# EAGLE design DTR-1_v2021-05-06 (EAGLE 7.6.0)
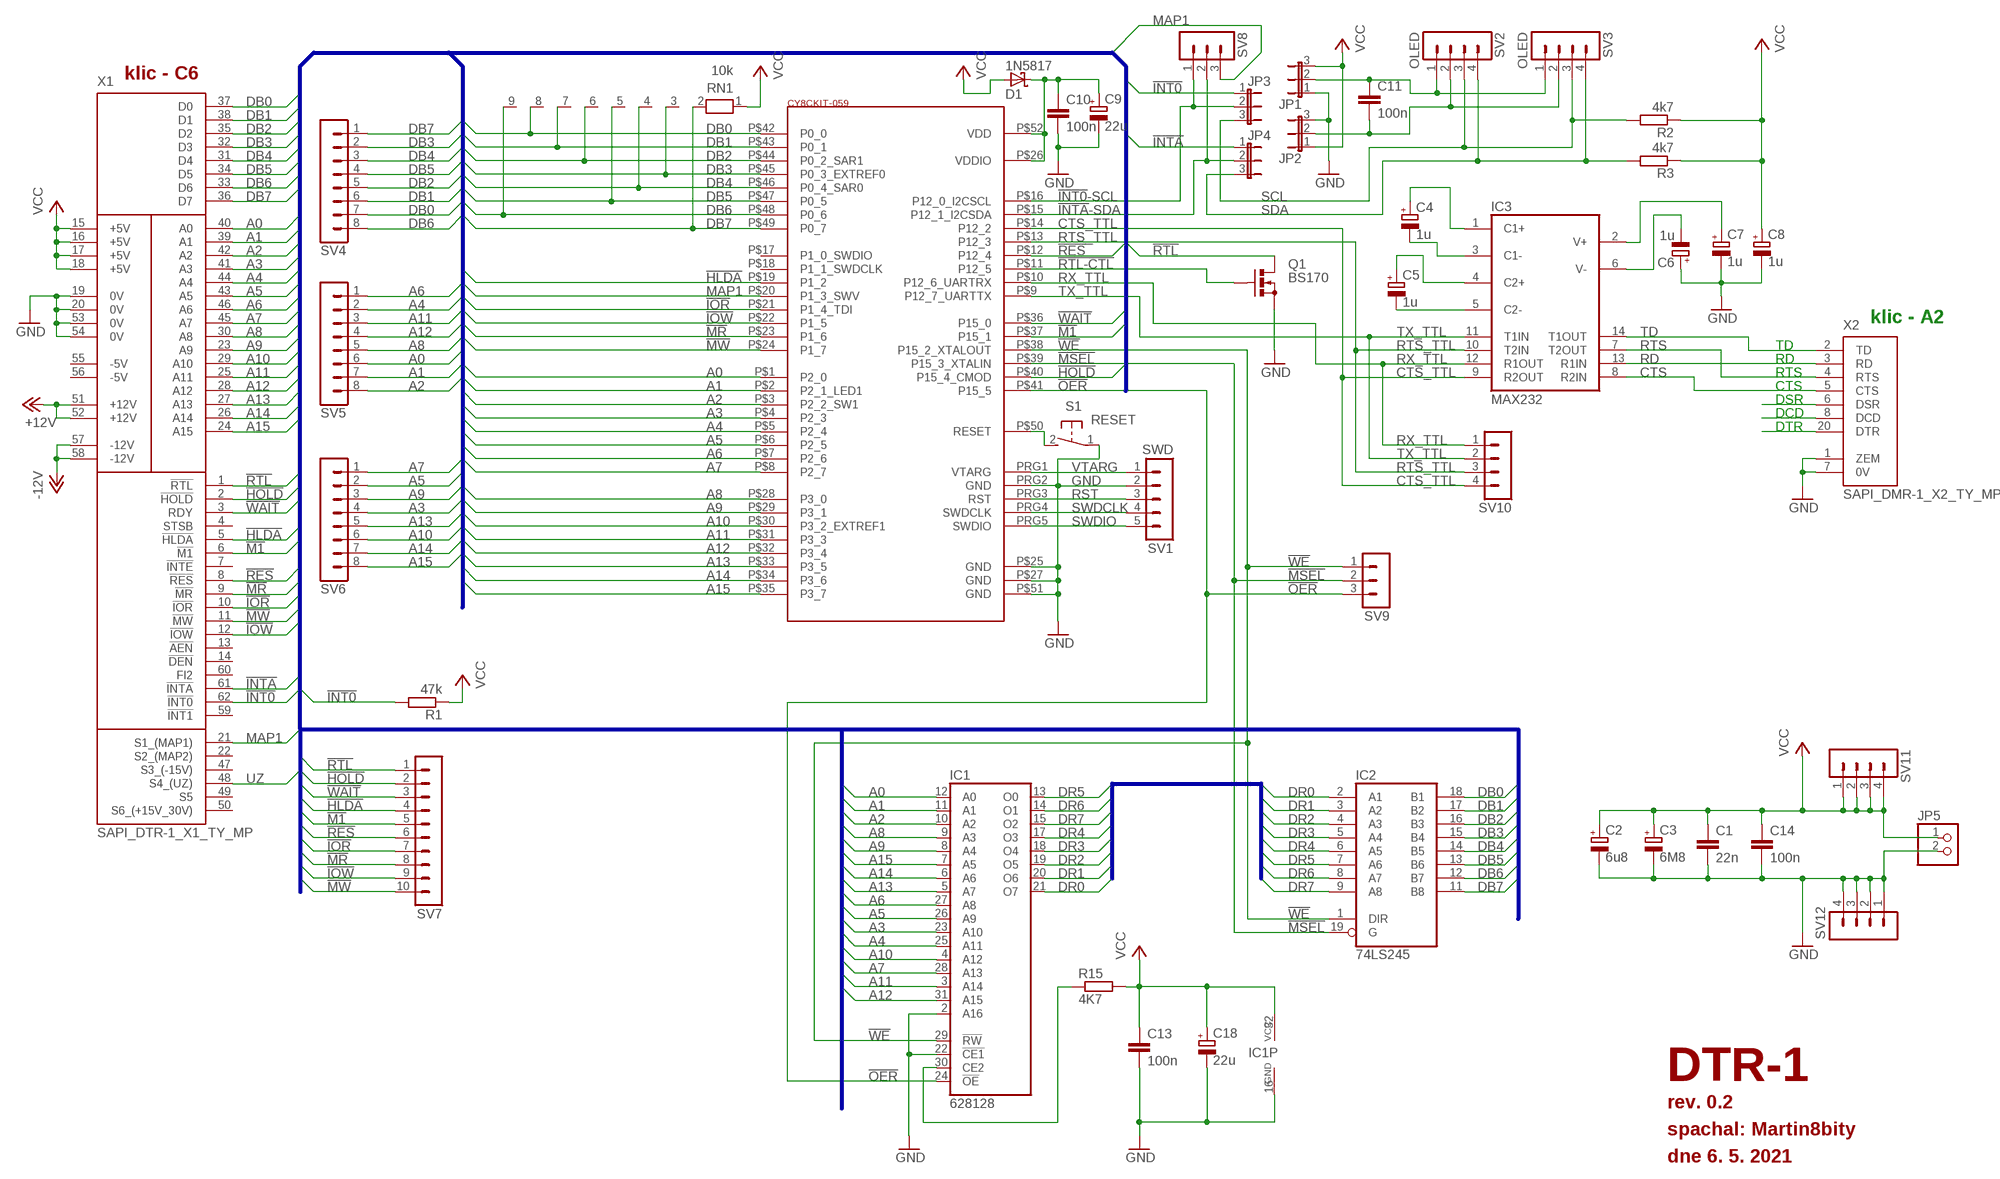
[diagram p0: schematic, sheet 1]

## Parts
C1  22n  C-EU025-024X044  [C025-024X044]
C2  6u8  CPOL-EUE5-4  [E5-4]
C3  6M8  CPOL-EUE2.5-5  [E2,5-5]
C4  1u  CPOL-EUE2.5-5  [E2,5-5]
C5  1u  CPOL-EUE2.5-5  [E2,5-5]
C6  1u  CPOL-EUE2.5-5  [E2,5-5]
C7  1u  CPOL-EUE2.5-5  [E2,5-5]
C8  1u  CPOL-EUE2.5-5  [E2,5-5]
C9  22u  CPOL-EUE2.5-5  [E2,5-5]
C10  100n  C-EU025-024X044  [C025-024X044]
C11  100n  C-EU050-025X075  [C050-025X075]
C13  100n  C-EU025-024X044  [C025-024X044]
C14  100n  C-EU025-024X044  [C025-024X044]
C18  22u  CPOL-EUE2.5-5  [E2,5-5]
D1  1N5817  1N5817-B  [DO41-7.6]
IC1  628128  TC551001CP  [DIL32]
IC2  74LS245  74LS245N  [DIL20]
IC3  MAX232  [DIL16]
JP1  JP2E  [JP2]
JP2  JP2E  [JP2]
JP3  JP2E  [JP2]
JP4  JP2E  [JP2]
JP5  PINHD-1X2  [1X02]
Q1  BS170  [SOT54E]
R1  47k  R-EU_0207/10  [0207/10]
R2  4k7  R-EU_0207/10  [0207/10]
R3  4k7  R-EU_0207/10  [0207/10]
R15  4K7  R-EU_0207/10  [0207/10]
RN1  10k  RN08  [RN-9]
S1  RESET  31-XX  [B3F-31XX]
SV1  SWD  MA05-1  [MA05-1]
SV2  OLED  MA04-1  [MA04-1]
SV3  OLED  MA04-1  [MA04-1]
SV4  MA08-1  [MA08-1]
SV5  MA08-1  [MA08-1]
SV6  MA08-1  [MA08-1]
SV7  MA10-1  [MA10-1]
SV8  MA03-1  [MA03-1]
SV9  MA03-1  [MA03-1]
SV10  MA04-1  [MA04-1]
SV11  MA04-1  [MA04-1]
SV12  MA04-1  [MA04-1]
U$1  CY8CKIT-059  [PSOC-KIT-26]
X1  SAPI_DTR-1_X1_TY_MP  [TY5176211/DTR-1_X1]
X2  SAPI_DMR-1_X2_TY_MP  [TY5133011/DMR-1_X2]

## Nets
!HLDA: SV7.4 U$1.P$19(P1_2) X1.5(!HLDA)
!HOLD: SV7.2 U$1.P$40(P15_4_CMOD) X1.2(!HOLD)
!INT0: JP3.1 R1.2 X1.62(!INT0)
!INT0!-SCL: JP3.2 SV8.1 U$1.P$16(P12_0_I2CSCL)
!INTA: JP4.1 X1.61(!INTA)
!INTA!-SDA: JP4.2 SV8.2 U$1.P$15(P12_1_I2CSDA)
!IOR: SV7.7 U$1.P$21(P1_4_TDI) X1.10(!IOR)
!IOW: SV7.9 U$1.P$22(P1_5) X1.12(!IOW)
!M1: SV7.5 U$1.P$37(P15_1) X1.6(!M1)
!MR: SV7.8 U$1.P$23(P1_6) X1.9(!MR)
!MSEL: IC2.19(G) SV9.2 U$1.P$39(P15_3_XTALIN)
!MW: SV7.10 U$1.P$24(P1_7) X1.11(!MW)
!OER: IC1.24(!OE) SV9.3 U$1.P$41(P15_5)
!RES: SV7.6 U$1.P$12(P12_4) X1.8(!RES)
!RTL: Q1.D SV7.1 X1.1(!RTL)
!RTL-CTL: Q1.G U$1.P$11(P12_5)
!WAIT: SV7.3 U$1.P$36(P15_0) X1.3(RDY)
!WE: IC1.29(!RW) IC2.1(DIR) SV9.1 U$1.P$38(P15_2_XTALOUT)
+12V: X1.51(+12V) X1.52(+12V)
-12V: X1.57(-12V) X1.58(-12V)
A0: IC1.12(A0) SV5.6 U$1.P$1(P2_0) X1.40(A0)
A1: IC1.11(A1) SV5.7 U$1.P$2(P2_1_LED1) X1.39(A1)
A2: IC1.10(A2) SV5.8 U$1.P$3(P2_2_SW1) X1.42(A2)
A3: IC1.23(A10) SV6.4 U$1.P$4(P2_3) X1.41(A3)
A4: IC1.25(A11) SV5.2 U$1.P$5(P2_4) X1.44(A4)
A5: IC1.26(A9) SV6.2 U$1.P$6(P2_5) X1.43(A5)
A6: IC1.27(A8) SV5.1 U$1.P$7(P2_6) X1.46(A6)
A7: IC1.28(A13) SV6.1 U$1.P$8(P2_7) X1.45(A7)
A8: IC1.9(A3) SV5.5 U$1.P$28(P3_0) X1.30(A8)
A9: IC1.8(A4) SV6.3 U$1.P$29(P3_1) X1.23(A9)
A10: IC1.4(A12) SV6.6 U$1.P$30(P3_2_EXTREF1) X1.29(A10)
A11: IC1.3(A14) SV5.3 U$1.P$31(P3_3) X1.25(A11)
A12: IC1.31(A15) SV5.4 U$1.P$32(P3_4) X1.28(A12)
A13: IC1.5(A7) SV6.5 U$1.P$33(P3_5) X1.27(A13)
A14: IC1.6(A6) SV6.7 U$1.P$34(P3_6) X1.26(A14)
A15: IC1.7(A5) SV6.8 U$1.P$35(P3_7) X1.24(A15)
CTS: IC3.8(R2IN) X2.5(CTS)
CTS_TTL: IC3.9(R2OUT) SV10.4 U$1.P$14(P12_2)
DB0: IC2.18(B1) RN1.8 SV4.7 U$1.P$42(P0_0) X1.37(D0)
DB1: IC2.17(B2) RN1.7 SV4.6 U$1.P$43(P0_1) X1.38(D1)
DB2: IC2.16(B3) RN1.6 SV4.5 U$1.P$44(P0_2_SAR1) X1.35(D2)
DB3: IC2.15(B4) RN1.3 SV4.2 U$1.P$45(P0_3_EXTREF0) X1.32(D3)
DB4: IC2.14(B5) RN1.4 SV4.3 U$1.P$46(P0_4_SAR0) X1.31(D4)
DB5: IC2.13(B6) RN1.5 SV4.4 U$1.P$47(P0_5) X1.34(D5)
DB6: IC2.12(B7) RN1.9 SV4.8 U$1.P$48(P0_6) X1.33(D6)
DB7: IC2.11(B8) RN1.2 SV4.1 U$1.P$49(P0_7) X1.36(D7)
DCD: X2.8(DCD)
DR0: IC1.21(O7) IC2.2(A1)
DR1: IC1.20(O6) IC2.3(A2)
DR2: IC1.19(O5) IC2.4(A3)
DR3: IC1.18(O4) IC2.5(A4)
DR4: IC1.17(O3) IC2.6(A5)
DR5: IC1.13(O0) IC2.7(A6)
DR6: IC1.14(O1) IC2.8(A7)
DR7: IC1.15(O2) IC2.9(A8)
DSR: X2.6(DSR)
DTR: X2.20(DTR)
GND: C1.2 C2.- C3.- C6.+ C7.- C8.- C9.- C10.2 C13.2 C14.2 C18.- IC1.2(A16) IC1.16(GND) IC1.22(!CE1) JP1.1 JP2.3 JP5.2 Q1.S S1.1(P) SV1.2 SV12.1 SV12.2 SV12.3 SV12.4 U$1.P$25(GND) U$1.P$27(GND) U$1.P$51(GND) U$1.PRG2(GND) X1.19(0V) X1.20(0V) X1.53(0V) X1.54(0V) X2.1(ZEM) X2.7(0V)
MAP1: SV8.3 U$1.P$20(P1_3_SWV) X1.21(S1_(MAP1))
N$1: C9.+ C10.1 D1.C U$1.P$26(VDDIO) U$1.P$52(VDD)
N$2: S1.2(S) U$1.P$50(RESET)
N$3: C11.1 JP1.2 SV2.1 SV3.1
N$4: C6.- IC3.6(V-)
N$5: C7.+ IC3.2(V+)
N$6: C5.- IC3.5(C2-)
N$7: C5.+ IC3.4(C2+)
N$8: C4.- IC3.3(C1-)
N$9: C4.+ IC3.1(C1+)
N$10: C11.2 JP2.2 SV2.2 SV3.2
N$44: IC1.30(CE2) R15.1
RD: IC3.13(R1IN) X2.3(RD)
RST: SV1.3 U$1.PRG3(RST)
RTS: IC3.7(T2OUT) X2.4(RTS)
RTS_TTL: IC3.10(T2IN) SV10.3 U$1.P$13(P12_3)
RX_TTL: IC3.12(R1OUT) SV10.1 U$1.P$10(P12_6_UARTRX)
SCL: JP3.3 R2.2 SV2.3 SV3.3
SDA: JP4.3 R3.2 SV2.4 SV3.4
SWDCLK: SV1.4 U$1.PRG4(SWDCLK)
SWDIO: SV1.5 U$1.PRG5(SWDIO)
TD: IC3.14(T1OUT) X2.2(TD)
TX_TTL: IC3.11(T1IN) SV10.2 U$1.P$9(P12_7_UARTTX)
UZ: X1.48(S4_(UZ))
VCC: C1.1 C2.+ C3.+ C8.+ C13.1 C14.1 C18.+ D1.A IC1.32(VCC) JP1.3 JP2.1 JP5.1 R1.1 R2.1 R3.1 R15.2 RN1.1 SV11.1 SV11.2 SV11.3 SV11.4 X1.15(+5V) X1.16(+5V) X1.17(+5V) X1.18(+5V)
VTARG: SV1.1 U$1.PRG1(VTARG)
Unconnected: IC1.1(NC) U$1.P$17(P1_0_SWDIO) U$1.P$18(P1_1_SWDCLK) X1.4(STSB) X1.7(!INTE) X1.13(!AEN) X1.14(!DEN) X1.22(S2_(MAP2)) X1.47(S3_(-15V)) X1.49(S5) X1.50(S6_(+15V_30V)) X1.55(-5V) X1.56(-5V) X1.59(!INT1) X1.60(FI2)

## Buses
DB[0..7],A[0..7],A[8..15],A16,!RES,!IOR,!IOW,!INT[0..1],!INTA,!MR,!MW,MAP[1..2],UZ,!RTL,!HOLD,!HLDA,!WAIT,!M1
DR[0..7]

## Notes on the sheet
- klic - C6
- klic - A2
- DTR-1
- rev. 0.2
- spachal: Martin8bity
- dne 6. 5. 2021

## Power pins joined to a net without a drawn wire
GND: IC2.10(GND) IC3.15(GND)
VCC: IC2.20(VCC) IC3.16(VCC)

## Library data of the parts
C1 C10 C11 C13 C14 = rcl:C-EU: CAPACITOR, European symbol
C2-C9 C18 = rcl:CPOL-EU: POLARIZED CAPACITOR, European symbol
D1 = diode:1N581*: 1.0A SCHOTTKY BARRIER RECTIFIER Source: http://www.diodes.com/datasheets/ds23001.pdf
IC1 = memory_MP:TC551001CP: MEMORY
IC2 = 74xx-eu_MP:74*245: Octal BUS TRANSCEIVER, 3-state
IC3 = maxim:MAX232: RS232 TRANSCEIVER; MF: MAXIM; MPN: MAX232ACPE+; OC_FARNELL: 9723773; OC_NEWARK: 68K4544
JP1-JP4 = jumper:JP2E: JUMPER
JP5 = pinhead:PINHD-1X2: PIN HEADER
Q1 = transistor-small-signal:BS170: N-CHANNEL MOS FET
R1-R3 R15 = rcl:R-EU_: RESISTOR, European symbol
RN1 = resistor-net:RN08: RESISTOR NETWORK; OC_FARNELL: unknown; OC_NEWARK: unknown
S1 = switch-omron:31-XX: OMRON SWITCH; MPN: B3F-3100; OC_FARNELL: 959704; OC_NEWARK: 36M3582
SV1 = con-lstb:MA05-1: PIN HEADER; OC_FARNELL: unknown; OC_NEWARK: unknown
SV2 SV3 SV10-SV12 = con-lstb:MA04-1: PIN HEADER; OC_FARNELL: unknown; OC_NEWARK: unknown
SV4-SV6 = con-lstb:MA08-1: PIN HEADER; OC_FARNELL: unknown; OC_NEWARK: unknown
SV7 = con-lstb:MA10-1: PIN HEADER; OC_FARNELL: unknown; OC_NEWARK: unknown
SV8 SV9 = con-lstb:MA03-1: PIN HEADER; OC_FARNELL: unknown; OC_NEWARK: unknown
U$1 = Cypress_PSoC:CY8CKIT-059
X1 = DTR-1_v2021-05-03:SAPI_DTR-1_X1_TY_MP
X2 = con-FRB_TESLA:SAPI_DMR-1_X2_TY_MP

## Board
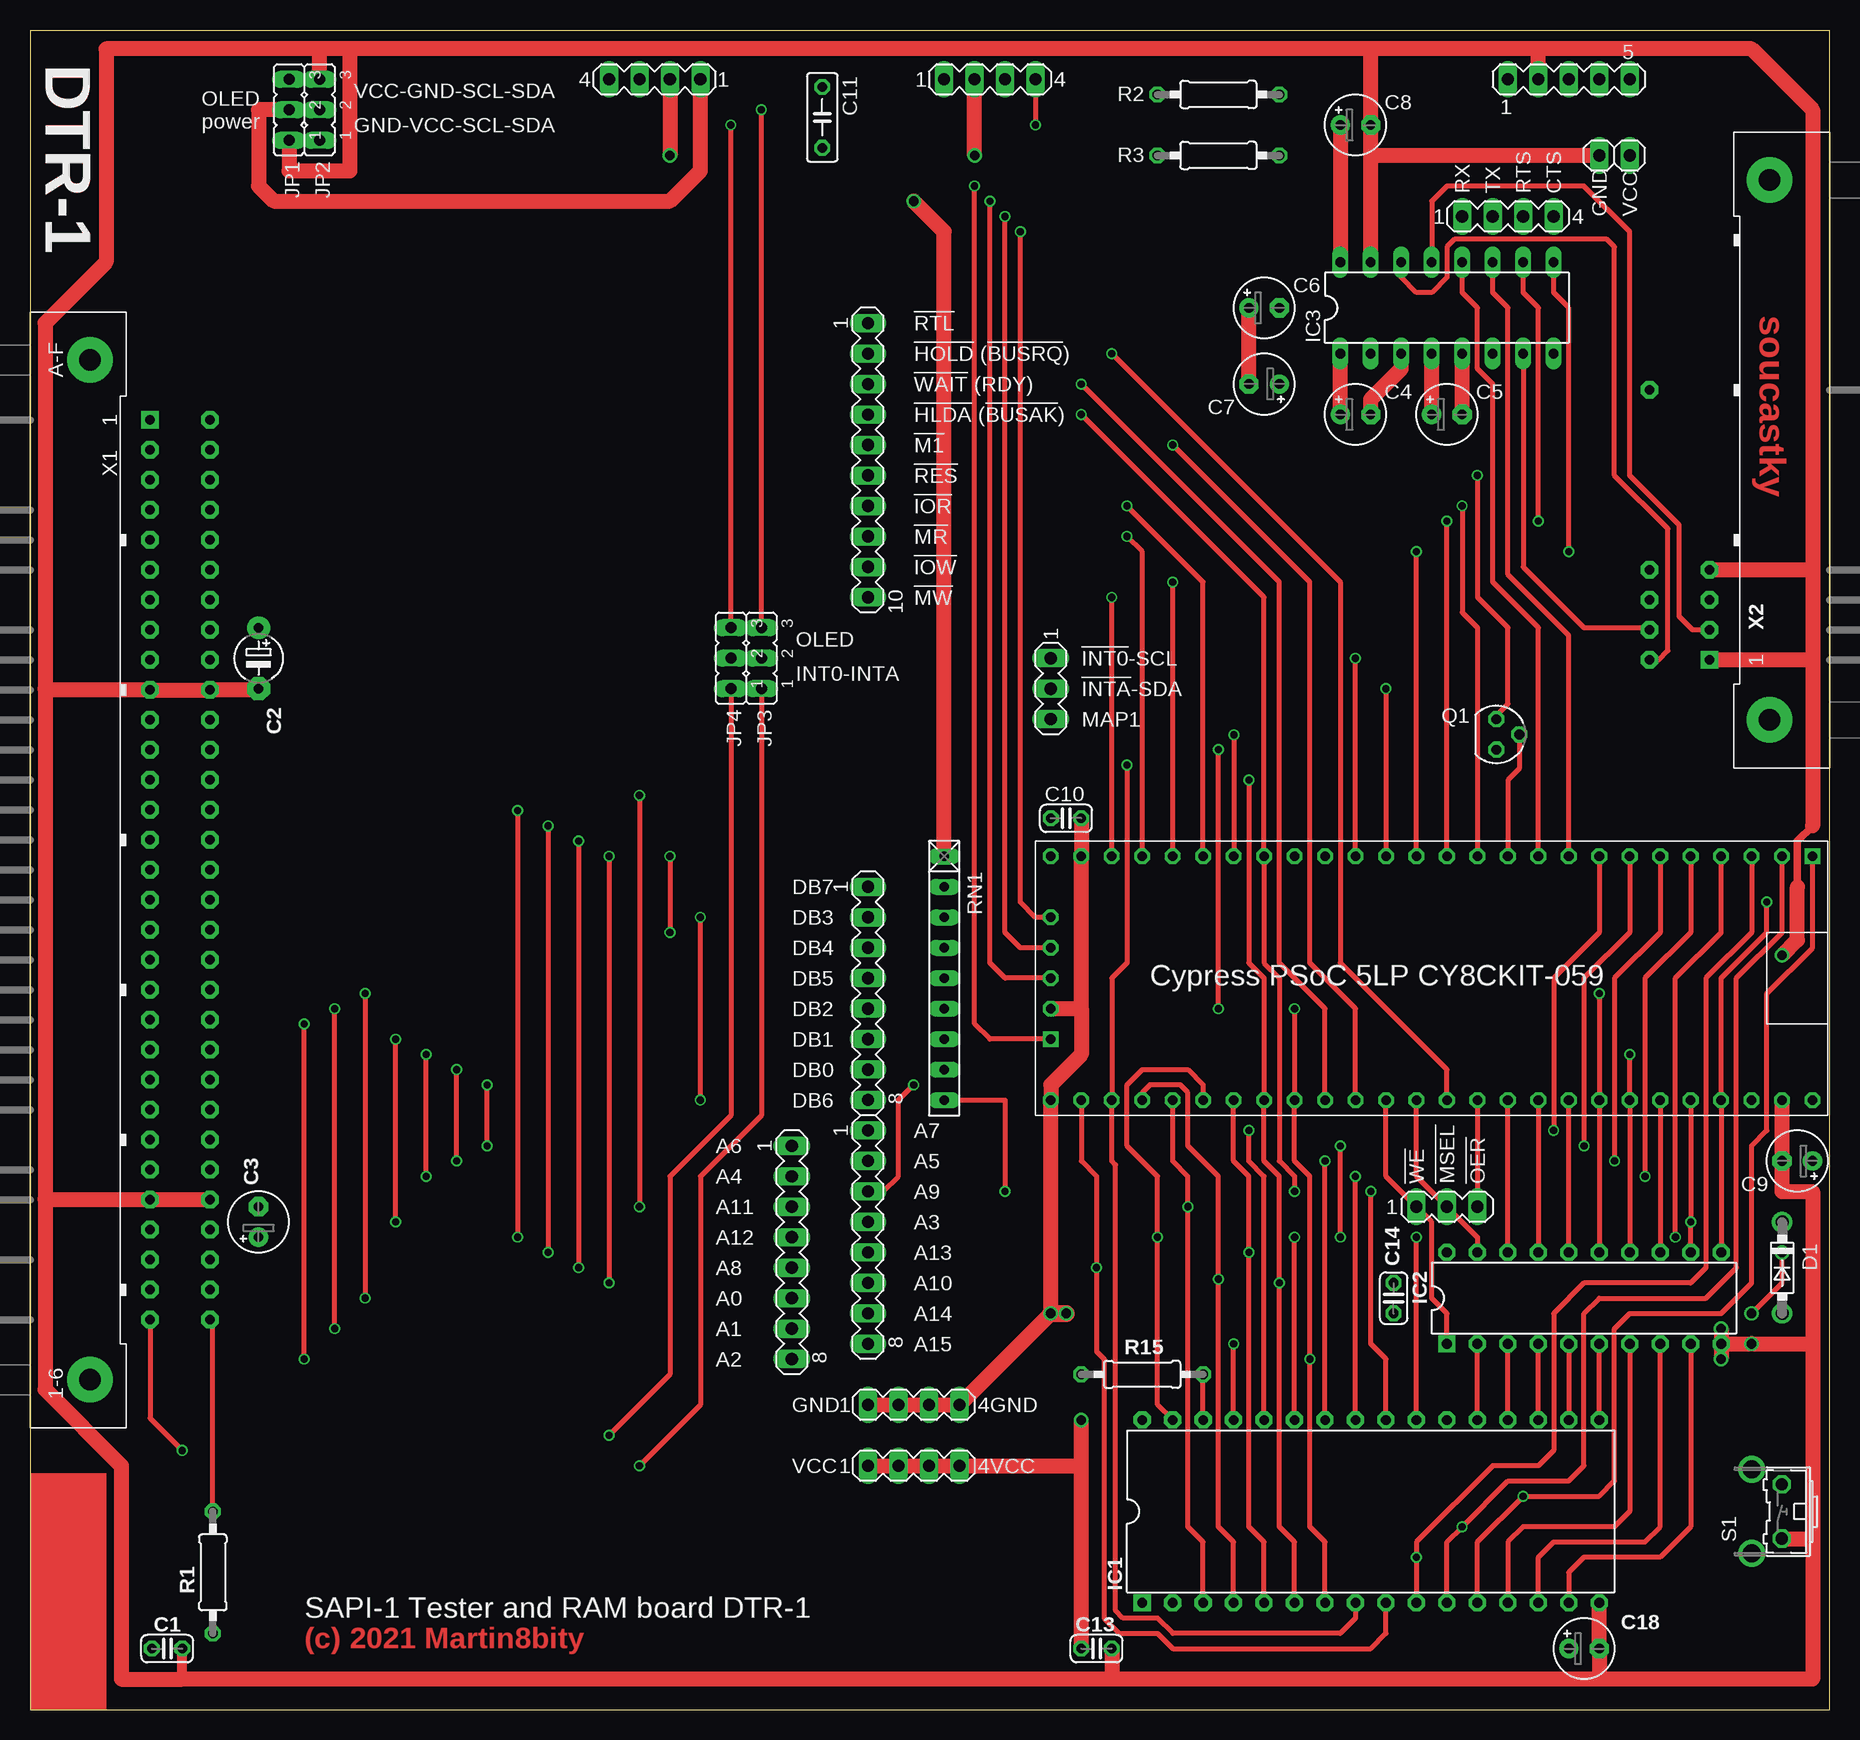
[diagram p1: board, top side]
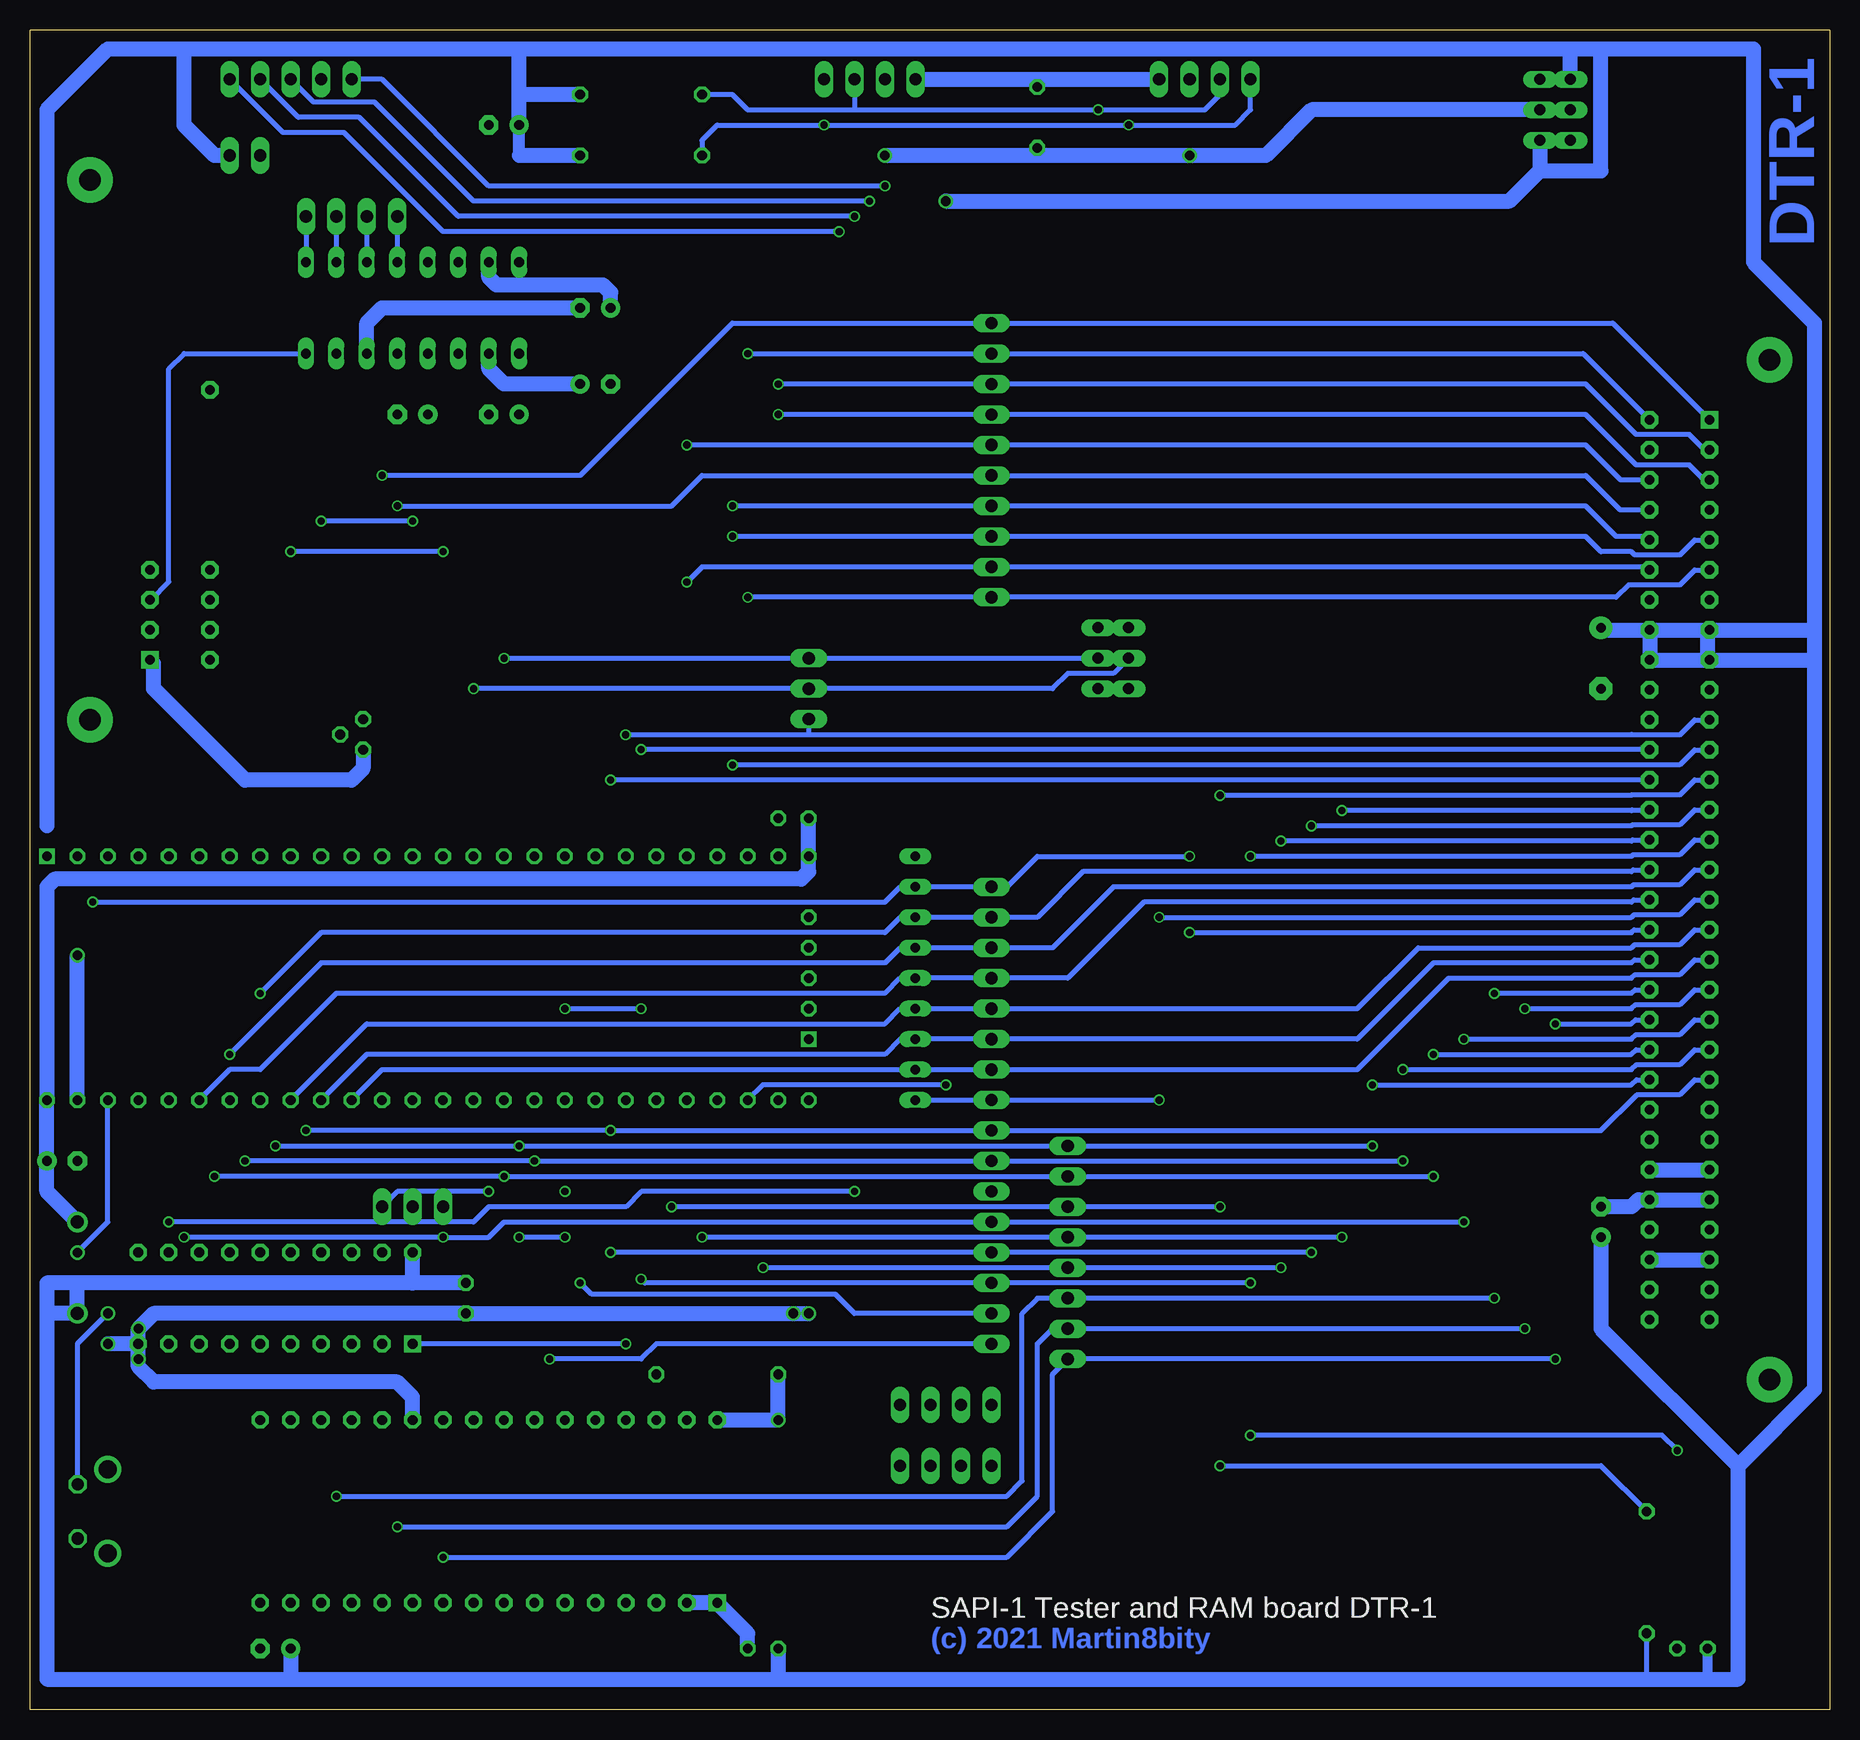
[diagram p2: board, bottom side, seen from below]

Size 150 x 140 mm. Coordinates in mm from the lower left corner, seen from the top.
Outline: 0,0 150,0 150,140 0,140 0,0
Copper layers (1*16): Top 0.035mm / dielectric 1.5mm / Bottom 0.035mm
Design rules "SeeedStudio_2layer_DRU_no_angle_20140221 *": minimum track width 6mil, minimum drill 12mil, track to track 6mil, track to pad 6mil, pad to pad 6mil, via to via 6mil, smd to smd 0mil, copper to edge 10mil, drill to drill 10mil, minimum pad ring 10mil, minimum via ring 6mil, stop-mask expansion 2mil, vias tented up to drill 100mil, thermal gap 10mil

### Footprints (pad centres in the part's own frame; a part is rotated, then mirrored left to right if it is on the bottom)
C025-024X044 = drill 0.813 octagon: 1 -1.27,0; 2 1.27,0
E5-4 = drill 0.813 pad 1.905: + -2.54,0 | drill 0.813 pad 1.905 octagon: - 2.54,0
E2,5-5 = drill 0.813 pad 1.6: + -1.27,0 | drill 0.813 pad 1.6 octagon: - 1.27,0
C050-025X075 = drill 0.813 octagon: 1 -2.54,0; 2 2.54,0
DO41-7.6 = drill 1.1 pad 1.7: A 3.81,0; C -3.81,0
DIL32 = drill 0.813 pad 1.422 square: 1 -19.05,-7.62 | drill 0.813 pad 1.422 octagon: 2 -16.51,-7.62; 3 -13.97,-7.62; 4 -11.43,-7.62; 5 -8.89,-7.62; 6 -6.35,-7.62; 7 -3.81,-7.62; 8 -1.27,-7.62; 9 1.27,-7.62; 10 3.81,-7.62; 11 6.35,-7.62; 12 8.89,-7.62; 13 11.43,-7.62; 14 13.97,-7.62; 15 16.51,-7.62; 16 19.05,-7.62; 17 19.05,7.62; 18 16.51,7.62; 19 13.97,7.62; 20 11.43,7.62; 21 8.89,7.62; 22 6.35,7.62; 23 3.81,7.62; 24 1.27,7.62; 25 -1.27,7.62; 26 -3.81,7.62; 27 -6.35,7.62; 28 -8.89,7.62; 29 -11.43,7.62; 30 -13.97,7.62; 31 -16.51,7.62; 32 -19.05,7.62
DIL20 = drill 0.813 pad 1.422 square: 1 -11.43,-3.81 | drill 0.813 pad 1.422 octagon: 2 -8.89,-3.81; 3 -6.35,-3.81; 4 -3.81,-3.81; 5 -1.27,-3.81; 6 1.27,-3.81; 7 3.81,-3.81; 8 6.35,-3.81; 9 8.89,-3.81; 10 11.43,-3.81; 11 11.43,3.81; 12 8.89,3.81; 13 6.35,3.81; 14 3.81,3.81; 15 1.27,3.81; 16 -1.27,3.81; 17 -3.81,3.81; 18 -6.35,3.81; 19 -8.89,3.81; 20 -11.43,3.81
DIL16 = drill 0.813 long: 1 -8.89,-3.81; 2 -6.35,-3.81; 3 -3.81,-3.81; 4 -1.27,-3.81; 5 1.27,-3.81; 6 3.81,-3.81; 7 6.35,-3.81; 8 8.89,-3.81; 9 8.89,3.81; 10 6.35,3.81; 11 3.81,3.81; 12 1.27,3.81; 13 -1.27,3.81; 14 -3.81,3.81; 15 -6.35,3.81; 16 -8.89,3.81
JP2 = drill 0.914 long: 1 -2.54,0; 2 0,0; 3 2.54,0
1X02 = drill 1.016 long: 1 -1.27,0; 2 1.27,0
SOT54E = drill 0.813 octagon: D -1.27,0; G 0,1.905; S 1.27,0
0207/10 = drill 0.813 octagon: 1 -5.08,0; 2 5.08,0
RN-9 = drill 0.813 long: 1 -10.16,0; 2 -7.62,0; 3 -5.08,0; 4 -2.54,0; 5 0,0; 6 2.54,0; 7 5.08,0; 8 7.62,0; 9 10.16,0
B3F-31XX = drill 1.016 octagon: 1 -2.261,-1.245; 2 2.261,-1.245 | drill 1.499 pad 2.159: 3 -3.505,1.245; 4 3.505,1.245
MA05-1 = drill 1.016 long: 1 -5.08,0; 2 -2.54,0; 3 0,0; 4 2.54,0; 5 5.08,0
MA04-1 = drill 1.016 long: 1 -3.81,0; 2 -1.27,0; 3 1.27,0; 4 3.81,0
MA08-1 = drill 1.016 long: 1 -8.89,0; 2 -6.35,0; 3 -3.81,0; 4 -1.27,0; 5 1.27,0; 6 3.81,0; 7 6.35,0; 8 8.89,0
MA10-1 = drill 1.016 long: 1 -11.43,0; 2 -8.89,0; 3 -6.35,0; 4 -3.81,0; 5 -1.27,0; 6 1.27,0; 7 3.81,0; 8 6.35,0; 9 8.89,0; 10 11.43,0
MA03-1 = drill 1.016 long: 1 -2.54,0; 2 0,0; 3 2.54,0
PSOC-KIT-26 = drill 0.8 square: P$1 31.75,10.16; PRG1 -31.75,-5.08 | drill 0.8 octagon: P$2 29.21,10.16; P$3 26.67,10.16; P$4 24.13,10.16; P$5 21.59,10.16; P$6 19.05,10.16; P$7 16.51,10.16; P$8 13.97,10.16; P$9 11.43,10.16; P$10 8.89,10.16; P$11 6.35,10.16; P$12 3.81,10.16; P$13 1.27,10.16; P$14 -1.27,10.16; P$15 -3.81,10.16; P$16 -6.35,10.16; P$17 -8.89,10.16; P$18 -11.43,10.16; P$19 -13.97,10.16; P$20 -16.51,10.16; P$21 -19.05,10.16; P$22 -21.59,10.16; P$23 -24.13,10.16; P$24 -26.67,10.16; P$25 -29.21,10.16; P$26 -31.75,10.16; P$27 -31.75,-10.16; P$28 -29.21,-10.16; P$29 -26.67,-10.16; P$30 -24.13,-10.16; P$31 -21.59,-10.16; P$32 -19.05,-10.16; P$33 -16.51,-10.16; P$34 -13.97,-10.16; P$35 -11.43,-10.16; P$36 -8.89,-10.16; P$37 -6.35,-10.16; P$38 -3.81,-10.16; P$39 -1.27,-10.16; P$40 1.27,-10.16; P$41 3.81,-10.16; P$42 6.35,-10.16; P$43 8.89,-10.16; P$44 11.43,-10.16; P$45 13.97,-10.16; P$46 16.51,-10.16; P$47 19.05,-10.16; P$48 21.59,-10.16; P$49 24.13,-10.16; P$50 26.67,-10.16; P$51 29.21,-10.16; P$52 31.75,-10.16; PRG2 -31.75,-2.54; PRG3 -31.75,0; PRG4 -31.75,2.54; PRG5 -31.75,5.08
TY5176211/DTR-1_X1 = drill 0.813 pad 1.422 square: 1 9,10 | drill 0.813 pad 1.422 octagon: 2 9,15; 3 11.5,10; 4 11.5,15; 5 14,10; 6 14,15; 7 16.5,10; 8 16.5,15; 9 19,10; 10 19,15; 11 21.5,10; 12 21.5,15; 13 24,10; 14 24,15; 15 26.5,10; 16 26.5,15; 17 29,10; 18 29,15; 19 31.5,10; 20 31.5,15; 21 34,10; 22 34,15; 23 36.5,10; 24 36.5,15; 25 39,10; 26 39,15; 27 41.5,10; 28 41.5,15; 29 44,10; 30 44,15; 31 46.5,10; 32 46.5,15; 33 49,10; 34 49,15; 35 51.5,10; 36 51.5,15; 37 54,10; 38 54,15; 39 56.5,10; 40 56.5,15; 41 59,10; 42 59,15; 43 61.5,10; 44 61.5,15; 45 64,10; 46 64,15; 47 66.5,10; 48 66.5,15; 49 69,10; 50 69,15; 51 71.5,10; 52 71.5,15; 53 74,10; 54 74,15; 55 76.5,10; 56 76.5,15; 57 79,10; 58 79,15; 59 81.5,10; 60 81.5,15; 61 84,10; 62 84,15 | drill 1.778 pad 3.81: P$1 4,5; P$2 89,5
TY5133011/DMR-1_X2 = drill 0.813 pad 1.422 square: 1 9,10 | drill 0.813 pad 1.422 octagon: 2 9,15; 3 11.5,10; 4 11.5,15; 5 14,10; 6 14,15; 7 16.5,10; 8 16.5,15; 20 31.5,15 | drill 1.778 pad 3.81: P$1 4,5; P$2 49,5

### Placement (x,y rotation side)
C1  11.43,5.08 0 top
C2  19.05,87.63 270 top
C3  19.05,40.64 90 top
C4  110.49,107.95 0 top
C5  118.11,107.95 0 top
C6  102.87,116.84 0 top
C7  102.87,110.49 180 top
C8  110.49,132.08 0 top
C9  147.32,45.72 180 top
C10  86.36,74.3 0 top
C11  66.04,132.72 270 top
C13  88.9,5.08 0 top
C14  113.67,34.29 270 top
C18  129.54,5.08 0 top
D1  146.05,36.83 270 top
IC1  111.76,16.51 0 top
IC2  129.54,34.29 0 top
IC3  118.11,116.84 0 top
JP1  21.59,133.35 90 top
JP2  24.13,133.35 90 top
JP3  60.96,87.63 90 top
JP4  58.42,87.63 90 top
JP5  132.08,129.54 180 top
Q1  122.24,81.28 270 top
R1  15.24,11.43 90 top
R2  99.06,134.62 180 top
R3  99.06,129.54 180 top
R15  92.71,27.94 180 top
RN1  76.2,60.96 270 top
S1  144.78,16.51 90 top
SV1  128.27,135.89 0 top
SV2  80.01,135.89 0 top
SV3  52.07,135.89 180 top
SV4  69.85,59.69 270 top
SV5  63.5,38.1 270 top
SV6  69.85,39.37 270 top
SV7  69.85,104.14 270 top
SV8  85.09,85.09 270 top
SV9  118.11,41.91 0 top
SV10  123.19,124.46 0 top
SV11  73.66,20.32 0 top
SV12  73.66,25.4 0 top
U$1  116.84,60.96 0 top
X1  0,116.5 270 top
X2  150,78.5 90 top

### Tracks (layer width: path | path; a pad name or v marks a point on that pad's centre or on a via)
!HLDA  (via drill 0.6)
  Top 0.406: v105.41,43.18 105.41,44.45 104.14,45.72 104.14,60.96 102.87,62.23 U$1.P$19 102.87,92.71 v87.63,107.95
  Bottom 0.406: X1.5 10.43,102.5 11.67,103.74 16.11,103.74 20.32,107.95 68.58,107.95 SV7.4 v87.63,107.95
!HOLD  (via drill 0.6)
  Top 0.406: U$1.P$40 118.11,53.34 109.22,62.23 109.22,93.98 v90.17,113.03
  Bottom 0.406: v90.17,113.03 SV7.2 68.58,113.03 20.53,113.03 X1.2
!INT0  (via drill 0.6)
  Top 0.406: R1.2 15.24,32.26 X1.62 | JP3.1 60.96,49.53 55.88,44.45 55.88,25.4 v50.8,20.32
  Bottom 0.406: v50.8,20.32 19.05,20.32 R1.2
!INT0!-SCL  (via drill 0.6)
  Top 0.406: U$1.P$16 v110.49,87.63
  Bottom 0.406: v110.49,87.63 86.36,87.63 SV8.1 JP3.2
!INTA  (via drill 0.6)
  Top 0.406: JP4.1 58.42,49.53 53.34,44.45 53.34,27.94 v48.26,22.86 | X1.61 10,24.29 v12.7,21.59
  Bottom 0.406: v12.7,21.59 13.97,22.86 v48.26,22.86
!INTA!-SDA  (via drill 0.6)
  Top 0.406: v113.03,85.09 U$1.P$15
  Bottom 0.406: JP4.2 59.69,86.36 63.5,86.36 64.77,85.09 SV8.2 86.36,85.09 v113.03,85.09
!IOR  (via drill 0.6)
  Top 0.406: U$1.P$21 97.79,93.98 v91.44,100.33
  Bottom 0.406: v91.44,100.33 SV7.7 68.58,100.33 20.32,100.33 17.78,97.79 15.24,97.79 15,97.55 X1.10
!IOW  (via drill 0.6)
  Top 0.406: U$1.P$22 v95.25,93.98
  Bottom 0.406: v95.25,93.98 93.98,95.25 SV7.9 68.58,95.25 15.24,95.25 X1.12
!M1  (via drill 0.6)
  Top 0.406: U$1.P$37 110.49,58.42 106.68,62.23 106.68,93.98 v95.25,105.41
  Bottom 0.406: v95.25,105.41 SV7.5 68.58,105.41 20.32,105.41 17.41,102.5 X1.6
!MR  (via drill 0.6)
  Top 0.406: U$1.P$23 92.71,96.52 v91.44,97.79
  Bottom 0.406: v91.44,97.79 SV7.8 68.58,97.79 20.32,97.79 19.05,96.52 16.51,96.52 16.24,96.25 12.5,96.25 11.25,97.5 X1.9
!MSEL
  Top 0.406: IC2.19 120.65,39.37 118.75,41.27 SV9.2 115.57,44.45 U$1.P$39
!MW  (via drill 0.6)
  Top 0.406: U$1.P$24 v90.17,92.71
  Bottom 0.406: X1.11 11.25,95 12.5,93.75 16.74,93.75 17.78,92.71 68.58,92.71 SV7.10 v90.17,92.71
!OER  (via drill 0.6)
  Top 0.406: IC1.24 113.03,29.21 111.76,30.48 v111.76,43.18 | U$1.P$41 SV9.3
  Bottom 0.406: v111.76,43.18 119.38,43.18 SV9.3
!RES  (via drill 0.6)
  Top 0.406: v119.38,100.33 119.38,91.44 120.65,90.17 U$1.P$12
  Bottom 0.406: v119.38,100.33 96.52,100.33 93.98,102.87 SV7.6 68.58,102.87 20.32,102.87 17.45,100 X1.8
!RTL  (via drill 0.6)
  Top 0.406: v120.65,102.87 120.65,92.71 123.19,90.17 123.19,83.82 122.24,82.87 Q1.D
  Bottom 0.406: v120.65,102.87 104.14,102.87 91.44,115.57 SV7.1 18.07,115.57 X1.1
!RTL-CTL
  Top 0.406: Q1.G 124.14,78.42 123.19,77.47 U$1.P$11
!WAIT  (via drill 0.6)
  Top 0.406: U$1.P$36 107.95,58.42 104.14,62.23 104.14,93.98 v87.63,110.49
  Bottom 0.406: X1.3 10.38,105 11.67,106.28 16.11,106.28 20.32,110.49 68.58,110.49 SV7.3 v87.63,110.49
!WE  (via drill 0.6)
  Top 0.406: IC2.1 118.11,33.02 116.84,34.29 116.84,40.64 SV9.1 113.03,44.45 U$1.P$38 | IC1.29 v100.33,30.48
  Bottom 0.406: v100.33,30.48 IC2.1
+12V
  Bottom 1.27: X1.52 X1.51
-12V
  Bottom 1.27: X1.58 X1.57
A0  (via drill 0.6)
  Top 0.406: IC1.12 120.65,13.97 v124.46,17.78 130.81,17.78 132.08,19.05 132.08,31.75 133.35,33.02 140.97,33.02 143.51,35.56 143.51,46.99 144.78,48.26 144.78,59.69 148.59,63.5 U$1.P$1 | v27.94,59.69 v27.94,34.29
  Bottom 0.406: v27.94,59.69 16.51,59.69 16.2,60 X1.40 | v124.46,17.78 68.58,17.78 67.31,19.05 67.31,33.02 66.04,34.29 SV5.6 v27.94,34.29
A1  (via drill 0.6)
  Top 0.406: IC1.11 118.11,13.97 v119.38,15.24 123.19,19.05 128.27,19.05 129.54,20.32 129.54,33.02 130.81,34.29 139.7,34.29 142.24,36.83 142.24,60.96 146.05,64.77 U$1.P$2 | v25.4,31.75 v25.4,58.42
  Bottom 0.406: v25.4,58.42 16.51,58.42 16.18,58.75 12.5,58.75 11.25,60 X1.39 | v119.38,15.24 68.58,15.24 66.04,17.78 66.04,30.48 64.77,31.75 SV5.7 v25.4,31.75
A2  (via drill 0.6)
  Top 0.406: U$1.P$3 143.51,64.77 139.7,60.96 139.7,36.83 138.43,35.56 129.54,35.56 127,33.02 127,21.59 125.73,20.32 121.92,20.32 115.57,13.97 v115.57,12.7 IC1.10 | v22.86,29.21 v22.86,57.15
  Bottom 0.406: v22.86,57.15 16.51,57.15 16.16,57.5 X1.42 | v115.57,12.7 68.58,12.7 64.77,16.51 64.77,27.94 SV5.8 v22.86,29.21
A3  (via drill 0.6)
  Top 0.406: IC1.23 v115.57,39.37 | v137.16,39.37 137.16,60.96 140.97,64.77 U$1.P$4 | v30.48,40.64 v30.48,55.88
  Bottom 0.406: v137.16,39.37 v115.57,39.37 111.76,39.37 110.49,40.64 SV6.4 v30.48,40.64 | v30.48,55.88 16.51,55.88 16.14,56.25 12.5,56.25 11.25,57.5 X1.41
A4  (via drill 0.6)
  Top 0.406: U$1.P$5 138.43,64.77 134.62,60.96 v134.62,44.45 | IC1.25 v110.49,44.45 | v33.02,44.45 v33.02,54.61
  Bottom 0.406: v134.62,44.45 v110.49,44.45 SV5.2 v33.02,44.45 | v33.02,54.61 16.51,54.61 16.12,55 X1.44
A5  (via drill 0.6)
  Top 0.406: U$1.P$6 135.89,64.77 132.08,60.96 v132.08,45.72 | IC1.26 v107.95,45.72 | v35.56,45.72 v35.56,53.34
  Bottom 0.406: v132.08,45.72 v107.95,45.72 SV6.2 68.58,45.72 v35.56,45.72 | v35.56,53.34 16.51,53.34 16.1,53.75 12.5,53.75 11.25,55 X1.43
A6  (via drill 0.6)
  Top 0.406: U$1.P$7 133.35,64.77 129.54,60.96 v129.54,46.99 | v38.1,46.99 v38.1,52.07 | IC1.27 v105.41,39.37 | v109.22,39.37 v109.22,46.99
  Bottom 0.406: v129.54,46.99 v109.22,46.99 SV5.1 v38.1,46.99 | v38.1,52.07 16.51,52.07 16.08,52.5 X1.46 | v105.41,39.37 v109.22,39.37
A7  (via drill 0.6)
  Top 0.406: U$1.P$8 130.81,64.77 127,60.96 v127,48.26 | IC1.28 102.87,44.45 101.6,45.72 v101.6,48.26
  Bottom 0.406: v127,48.26 v101.6,48.26 SV6.1 68.58,48.26 19.05,48.26 16.06,51.25 12.5,51.25 11.25,52.5 X1.45
A8  (via drill 0.6)
  Top 0.406: U$1.P$28 87.63,45.72 88.9,44.45 v88.9,36.83 88.9,29.84 89.53,29.21 89.53,7.62 90.81,6.35 93.98,6.35 95.25,5.08 111.76,5.08 113.03,6.35 IC1.9 | v45.72,72.39 v45.72,36.83
  Bottom 0.406: v45.72,72.39 16.51,72.39 16.4,72.5 X1.30 | v45.72,36.83 SV5.5 v88.9,36.83
A9  (via drill 0.6)
  Top 0.406: IC1.8 110.49,7.62 109.22,6.35 95.25,6.35 93.98,7.62 91.12,7.62 90.49,8.26 90.49,45.4 90.17,45.72 U$1.P$29 90.17,60.96 91.44,62.23 v91.44,78.74 | SV6.3 71.12,43.18 72.39,44.45 72.39,50.8 v73.66,52.07
  Bottom 0.406: 16.51,78.75 12.5,78.75 11.25,80 X1.23 | 16.51,78.75 16.51,78.74 | 16.51,78.75 88.89,78.75 | 88.89,78.75 88.9,78.74 | 88.89,78.75 v91.43,78.75 v91.44,78.74 | v73.66,52.07 88.9,52.07 U$1.P$29
A10  (via drill 0.6)
  Top 0.406: IC1.4 100.33,13.97 99.06,15.24 v99.06,35.88 99.06,44.45 96.52,46.99 96.52,51.44 95.89,52.07 93.34,52.07 92.71,51.44 U$1.P$30 | v48.26,71.12 v48.26,35.56
  Bottom 0.406: v48.26,71.12 16.51,71.12 16.38,71.25 12.5,71.25 11.25,72.5 X1.29 | v48.26,35.56 68.58,35.56 SV6.6 98.74,35.56 v99.06,35.88
A11  (via drill 0.6)
  Top 0.406: IC1.3 97.79,13.97 96.52,15.24 v96.52,41.91 96.52,44.45 95.25,45.72 U$1.P$31 | v50.8,76.2 v50.8,41.91
  Bottom 0.406: v50.8,76.2 16.51,76.2 16.51,76.25 12.5,76.25 11.25,77.5 X1.25 | v50.8,41.91 SV5.3 v96.52,41.91
A12  (via drill 0.6)
  Top 0.406: IC1.31 93.98,25.4 v93.98,39.37 93.98,44.45 91.44,46.99 91.44,52.07 92.71,53.34 96.52,53.34 97.79,52.07 U$1.P$32 | v40.64,74.93 v40.64,39.37
  Bottom 0.406: v40.64,74.93 16.51,74.93 16.44,75 X1.28 | v40.64,39.37 SV5.4 v93.98,39.37
A13  (via drill 0.6)
  Top 0.406: IC1.5 102.87,13.97 101.6,15.24 v101.6,38.1 101.6,44.45 100.33,45.72 U$1.P$33 | v43.18,73.66 v43.18,38.1
  Bottom 0.406: v43.18,73.66 16.51,73.66 16.42,73.75 12.5,73.75 11.25,75 X1.27 | v43.18,38.1 68.58,38.1 SV6.5 v101.6,38.1
A14  (via drill 0.6)
  Top 0.406: IC1.6 105.41,13.97 104.14,15.24 v104.14,35.56 104.14,44.45 102.87,45.72 U$1.P$34 102.87,60.96 101.6,62.23 v101.6,77.47
  Bottom 0.406: v101.6,77.47 15.24,77.47 15.21,77.5 X1.26 | SV6.7 81.28,33.02 82.87,34.61 103.19,34.61 v104.14,35.56
A15  (via drill 0.6)
  Top 0.406: IC1.7 107.95,13.97 106.68,15.24 v106.68,29.21 106.68,44.45 105.41,45.72 U$1.P$35 v105.41,58.42 | v99.06,58.42 v99.06,80.01
  Bottom 0.406: v99.06,80.01 15.24,80.01 15.23,80 X1.24 | v105.41,58.42 v99.06,58.42 | SV6.8 97.79,30.48 99.06,29.21 v106.68,29.21
CTS
  Bottom 0.406: X2.5 139.91,92.5 138.43,93.98 138.43,111.76 137.16,113.03 IC3.8
CTS_TTL  (via drill 0.6)
  Top 0.406: v128.27,96.52 128.27,116.84 127,118.11 IC3.9 | U$1.P$14 v115.57,96.52
  Bottom 0.406: v115.57,96.52 v128.27,96.52 | SV10.4 IC3.9
DB0
  Top 0.406: IC2.18 U$1.P$42
  Bottom 0.406: U$1.P$42 120.65,53.34 RN1.8 71.12,53.34 SV4.7 39.37,53.34 31.75,60.96 16.51,60.96 16.22,61.25 12.5,61.25 11.25,62.5 X1.37
DB1
  Top 0.406: U$1.P$43 IC2.17
  Bottom 0.406: U$1.P$43 121.92,54.61 78.74,54.61 77.47,55.88 RN1.7 71.12,55.88 SV4.6 39.37,55.88 33.02,62.23 16.51,62.23 16.24,62.5 X1.38
DB2
  Top 0.406: IC2.16 U$1.P$44
  Bottom 0.406: U$1.P$44 121.92,57.15 78.74,57.15 77.47,58.42 RN1.6 71.12,58.42 SV4.5 39.37,58.42 34.29,63.5 16.51,63.5 16.26,63.75 12.5,63.75 11.25,65 X1.35
DB3  (via drill 0.6)
  Top 0.406: IC2.15 U$1.P$45 v130.81,59.69
  Bottom 0.406: v130.81,59.69 125.73,64.77 78.74,64.77 77.47,66.04 RN1.3 71.12,66.04 SV4.2 66.04,66.04 62.23,69.85 16.51,69.85 16.36,70 X1.32
DB4  (via drill 0.6)
  Top 0.406: IC2.14 U$1.P$46 v133.35,54.61
  Bottom 0.406: v133.35,54.61 125.73,62.23 78.74,62.23 77.47,63.5 RN1.4 71.12,63.5 SV4.3 64.77,63.5 59.69,68.58 16.51,68.58 16.34,68.75 12.5,68.75 11.25,70 X1.31
DB5
  Top 0.406: U$1.P$47 IC2.13
  Bottom 0.406: U$1.P$47 133.35,53.34 130.81,53.34 124.46,59.69 78.74,59.69 77.47,60.96 RN1.5 71.12,60.96 SV4.4 63.5,60.96 57.15,67.31 16.51,67.31 16.32,67.5 X1.34
DB6  (via drill 0.6)
  Top 0.406: v55.88,50.8 v55.88,66.04 | IC2.12 v138.43,40.64 U$1.P$48 | RN1.9 81.28,50.8 v81.28,43.18
  Bottom 0.406: v55.88,66.04 16.51,66.04 16.3,66.25 12.5,66.25 11.25,67.5 X1.33 | v81.28,43.18 99.06,43.18 100.33,41.91 111.76,41.91 113.03,40.64 v138.43,40.64 | RN1.9 SV4.8 v55.88,50.8
DB7  (via drill 0.6)
  Top 0.406: IC2.11 U$1.P$49 140.97,60.96 144.78,64.77 v144.78,67.31 | v53.34,71.12 v53.34,64.77
  Bottom 0.406: v144.78,67.31 78.74,67.31 77.47,68.58 RN1.2 71.12,68.58 SV4.1 68.58,68.58 66.04,71.12 v53.34,71.12 | v53.34,64.77 16.51,64.77 16.28,65 X1.36
DR0
  Top 0.406: IC1.21 IC2.2
DR1
  Top 0.406: IC1.20 IC2.3
DR2
  Top 0.406: IC1.19 IC2.4
DR3
  Top 0.406: IC2.5 IC1.18
DR4
  Top 0.406: IC1.17 IC2.6
DR5
  Top 0.406: IC2.7 133.35,16.51 132.08,15.24 124.46,15.24 123.19,13.97 IC1.13
DR6
  Top 0.406: IC1.14 125.73,12.7 127,13.97 134.62,13.97 135.89,15.24 IC2.8
DR7
  Top 0.406: IC2.9 138.43,15.24 135.89,12.7 129.54,12.7 128.27,11.43 IC1.15
GND  (via drill 0.8)
  Top 0.61: 147.32,68.58 147.32,72.39 148.59,73.66
  Top 0.813: 1.27,85.09 1.27,85 | 148.59,95.25 148.59,95 | 148.59,87.63 148.59,87.5 | 12.7,2.54 C1.2
  Top 1.27: 130.81,2.54 148.59,2.54 148.59,13.97 | 130.81,2.54 90.17,2.54 | 90.17,2.54 12.7,2.54 7.62,2.54 7.62,20.32 1.27,26.67 1.27,42.55 | 1.27,85.09 1.27,42.55 | 1.27,85.09 1.27,115.57 6.35,120.65 6.35,138.43 24.13,138.43 | 125.73,138.43 143.51,138.43 148.59,133.35 148.59,95.25 148.59,87.63 148.59,73.66 | 125.73,138.43 111.76,138.43 | 111.76,138.43 26.67,138.43 | 26.67,138.43 24.13,138.43 | 148.59,30.48 148.59,43.18 146.05,43.18 C9.- U$1.P$51 | 148.59,30.48 148.59,13.97 | 148.59,95 X2.7 | 148.59,87.5 X2.1 | 130.81,2.54 C18.- IC1.16 | C13.2 90.17,2.54 | C7.- C6.+ | 111.76,138.43 C8.- 111.76,129.54 | IC3.15 111.76,129.54 | U$1.PRG2 87.63,58.42 | 87.63,58.42 87.63,54.61 85.09,52.07 U$1.P$27 v85.09,33.02 SV12.4 SV12.3 SV12.2 SV12.1 | 87.63,58.42 U$1.P$25 C10.2 | SV1.2 125.73,138.43 | v146.05,62.87 147.32,64.14 147.32,68.58 | X1.54 X1.53 1.31,42.5 1.27,42.55 | 1.27,85.09 1.36,85 X1.19 X1.20 18.96,85 C2.- | IC2.10 v143.51,30.48 148.59,30.48 | S1.1 148.31,14.25 148.59,13.97 | JP2.3 24.13,138.43 | JP1.1 21.59,128.27 26.67,128.27 26.67,138.43 | v140.97,31.75 v140.97,29.21 | JP5.2 111.76,129.54
  Top 1.422: v85.09,33.02 v86.36,33.02
  Bottom 1.27: C3.- 16.51,41.91 15.92,42.5 X1.54 X1.53 | IC2.10 v140.97,31.75 139.7,33.02 C14.2 v86.36,33.02 v85.09,33.02 | C6.+ 101.6,118.11 102.23,118.75 111.12,118.75 111.76,119.38 IC3.15 | U$1.P$51 v146.05,62.87 | C13.2 90.17,6.35 92.71,8.89 IC1.2 | IC1.22 118.11,26.04 119.38,27.3 139.7,27.3 140.97,28.57 v140.97,29.21 IC2.10 | IC2.10 v143.51,30.48 | Q1.S 122.24,78.42 123.19,77.47 132.08,77.47 139.7,85.09 139.7,87.2 X2.1
MAP1  (via drill 0.6)
  Top 0.406: v100.36,81.25 100.36,71.15 U$1.P$20
  Bottom 0.406: 16.51,81.25 12.5,81.25 11.25,82.5 X1.21 | 16.51,81.25 16.51,81.28 | 16.51,81.25 85.09,81.25 | 85.09,81.25 v100.36,81.25 | SV8.3 85.09,81.25
N$1
  Bottom 1.27: C10.1 U$1.P$26 85.09,69.85 85.72,69.22 147.96,69.22 148.59,68.58 U$1.P$52 C9.+ 148.59,43.18 D1.C
N$2  (via drill 0.8)
  Top 0.406: v143.51,33.02 146.05,35.56 v146.05,38.1
  Bottom 0.406: S1.2 146.03,30.5 v143.51,33.02 | v146.05,38.1 143.51,40.64 U$1.P$50
N$3
  Top 1.27: JP1.2 19.05,133.35 19.05,127 20.32,125.73 53.34,125.73 55.88,128.27 SV3.1
  Bottom 1.27: SV2.1 66.04,135.89 | 66.04,135.89 SV3.1 | C11.1 66.04,135.89
N$4
  Bottom 1.27: IC3.6 121.92,115.57 120.65,116.84 C6.-
N$5
  Bottom 1.27: C7.+ 110.49,110.49 111.76,111.76 IC3.2
N$6
  Top 1.27: C5.- IC3.5
N$7
  Top 1.27: C5.+ IC3.4
N$8
  Top 1.27: C4.- 111.76,109.22 114.3,111.76 IC3.3
N$9
  Top 1.27: C4.+ IC3.1
N$10  (via drill 0.8)
  Top 1.27: v78.74,129.54 SV2.2 | SV3.2 v53.34,129.54
  Bottom 1.27: JP2.2 43.18,133.35 46.99,129.54 v53.34,129.54 66.04,129.54 | 66.04,129.54 v78.74,129.54 | C11.2 66.04,129.54
N$44
  Top 0.406: IC1.30 R15.1
RD
  Top 0.406: X2.3 138.6,90 137.48,91.12 137.48,98.74 133.35,102.87 133.35,123.19 129.54,127 118.11,127 116.84,125.73 IC3.13
RST  (via drill 0.6)
  Top 0.406: U$1.PRG3 81.28,60.96 80.01,62.23 v80.01,125.73
  Bottom 0.406: v80.01,125.73 113.03,125.73 121.28,133.99 126.36,133.99 SV1.3
RTS
  Top 0.406: IC3.7 124.46,95.25 129.54,90.17 134.83,90.17 X2.4
RTS_TTL  (via drill 0.6)
  Top 0.406: U$1.P$13 v118.11,99.06 | v125.73,99.06 125.73,116.84 124.46,118.11 IC3.10
  Bottom 0.406: v118.11,99.06 v125.73,99.06 | SV10.3 IC3.10
RX_TTL
  Top 0.406: U$1.P$10 125.73,90.17 121.92,93.98 121.92,110.49 120.65,111.76 120.65,116.84 119.38,118.11 IC3.12
  Bottom 0.406: SV10.1 IC3.12
SCL  (via drill 0.6)
  Top 0.406: JP3.3 v60.96,133.35
  Bottom 0.406: 81.28,133.35 90.17,133.35 91.44,134.62 R2.2 | 81.28,133.35 v60.96,133.35 52.07,133.35 50.8,134.62 SV3.3 | SV2.3 81.28,133.35
SDA  (via drill 0.6)
  Top 0.406: SV2.4 v83.82,132.08 | JP4.3 v58.42,132.08
  Bottom 0.406: SV3.4 48.26,133.35 49.53,132.08 v58.42,132.08 v83.82,132.08 92.71,132.08 93.98,130.81 R3.2
SWDCLK  (via drill 0.6)
  Top 0.406: U$1.PRG4 82.55,63.5 81.28,64.77 v81.28,124.46
  Bottom 0.406: v81.28,124.46 114.3,124.46 122.56,132.72 127.64,132.72 SV1.4
SWDIO  (via drill 0.6)
  Top 0.406: U$1.PRG5 83.82,66.04 82.55,67.31 v82.55,123.19
  Bottom 0.406: v82.55,123.19 115.57,123.19 123.83,131.44 128.91,131.44 SV1.5
TD
  Top 0.406: X2.2 135.76,87.5 136.53,88.27 136.53,98.42 132.08,102.87 132.08,121.92 131.44,122.56 118.75,122.56 118.11,121.92 118.11,119.38 116.84,118.11 115.57,118.11 114.3,119.38 IC3.14
TX_TTL
  Top 0.406: U$1.P$9 128.27,89.53 123.19,94.61 123.19,116.84 121.92,118.11 IC3.11
  Bottom 0.406: SV10.2 IC3.11
VCC  (via drill 0.8)
  Top 1.27: C13.1 87.63,20.32 | 87.63,20.32 v87.63,24.13 | C8.+ IC3.16 | RN1.1 76.2,123.19 v73.66,125.73 | SV11.1 SV11.2 SV11.3 SV11.4 87.63,20.32
  Bottom 0.406: 15.24,2.54 R1.1
  Bottom 0.813: 1.27,87.63 1.27,87.5 | 10.16,2.54 C1.1
  Bottom 1.016: 109.22,129.54 C8.+
  Bottom 1.27: 128.27,2.54 148.59,2.54 148.59,33.02 | 128.27,2.54 87.63,2.54 | 87.63,2.54 15.24,2.54 10.16,2.54 7.62,2.54 7.62,20.32 | 7.62,20.32 1.27,26.67 1.27,87.63 | 148.59,73.66 148.59,133.35 143.51,138.43 137.16,138.43 | 148.59,33.02 148.59,35.56 146.05,35.56 | 137.16,138.43 109.22,138.43 | 109.22,138.43 21.59,138.43 | 21.59,138.43 19.05,138.43 | 19.05,138.43 6.35,138.43 6.35,120.65 1.27,115.57 1.27,90.17 | 1.27,90.17 1.27,87.63 | C18.+ 128.27,2.54 | C13.1 87.63,2.54 | R15.2 v87.63,24.13 IC1.32 | C8.+ 109.22,134.62 | 109.22,134.62 109.22,138.43 | 1.27,90.17 1.44,90 X1.15 X1.16 18.88,90 C2.+ | X1.17 1.4,87.5 1.27,87.63 | X1.17 X1.18 14.92,87.58 14.92,89.85 | 10.16,89.85 10.16,87.63 10.13,87.63 X1.17 | C3.+ 19.05,31.75 7.62,20.32 | C14.1 118.11,35.56 | 118.11,35.56 IC2.20 | 118.11,35.56 146.05,35.56 | 148.59,33.02 D1.A 146.05,35.56 | JP1.3 21.59,138.43 | JP2.1 24.13,128.27 | 24.13,128.27 19.05,128.27 19.05,138.43 | R3.1 109.22,129.54 | R2.1 109.22,134.62 | v73.66,125.73 26.67,125.73 24.13,128.27 | JP5.1 134.62,129.54 137.16,132.08 137.16,138.43
VTARG  (via drill 0.6)
  Top 0.406: U$1.PRG1 80.01,55.88 78.74,57.15 v78.74,127
  Bottom 0.406: v78.74,127 111.76,127 120.65,135.89 SV1.1
(copper drawn outside any net)
  shapes: Top area x1

### Text on the board
Top: DTR-1 | soucastky | (c) 2021 Martin8bity
Bottom: DTR-1 | (c) 2021 Martin8bity
tPlace: DTR-1
tNames: VCC-GND-SCL-SDA | OLED / power | GND-VCC-SCL-SDA | RX / TX / RTS / CTS | GND | VCC | !RTL / !HOLD! (!BUSRQ!) / !WAIT! (RDY) / !HLDA! (!BUSAK!) / !M1 / !RES / !IOR / !MR / !IOW / !MW | OLED | INT0-INTA | !INT0!-SCL / !INTA!-SDA / MAP1 | DB7 / DB3 / DB4 / DB5 / DB2 / DB1 / DB0 / DB6 | !WE / !MSEL / !OER | A7 / A5 / A9 / A3 / A13 / A10 / A14 / A15 | A6 / A4 / A11 / A12 / A8 / A0 / A1 / A2 | GND / / VCC | GND / / VCC | SAPI-1 Tester and RAM board DTR-1
bNames: SAPI-1 Tester and RAM board DTR-1
tStop: (c) 2021 Martin8bity
bStop: (c) 2021 Martin8bity